# EAGLE schematic adc2 (EAGLE 5.06)
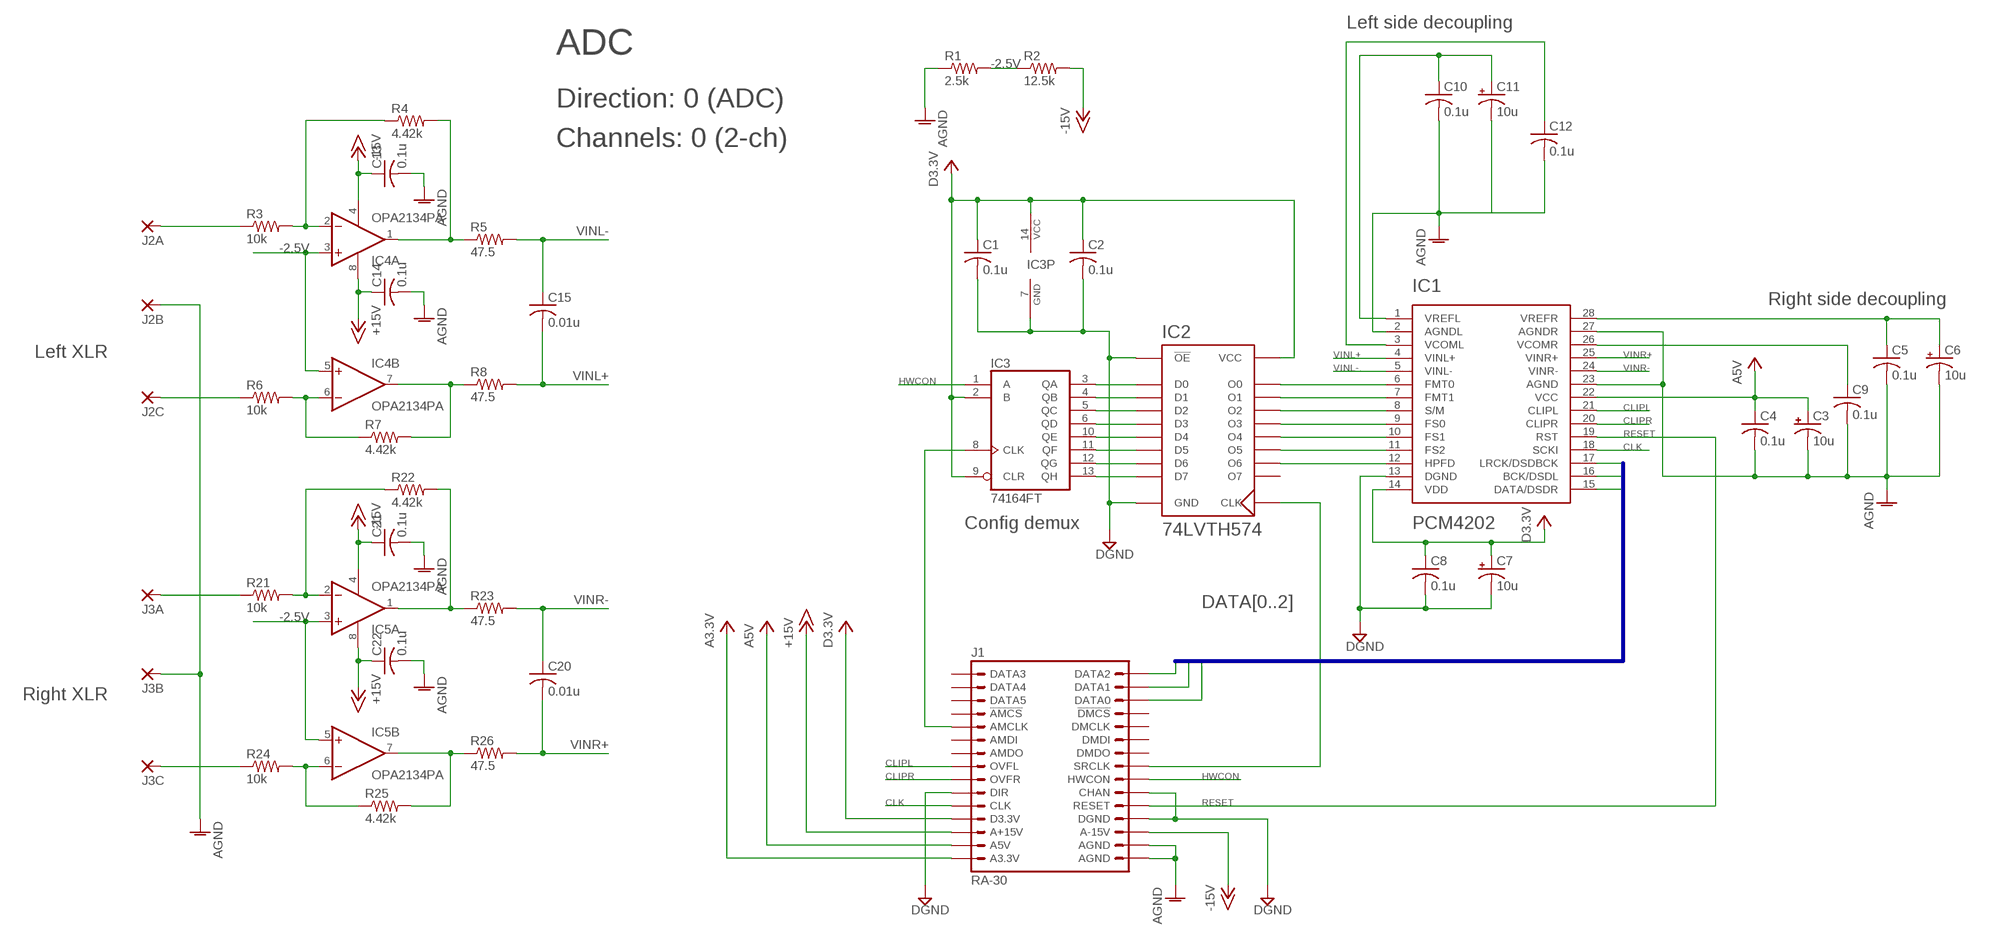
[diagram p0: schematic, sheet 1]

## Parts
C1  0.1u  C-USC1206  [C1206]
C2  0.1u  C-USC1206  [C1206]
C3  10u  CPOL-USC/6032-28R  [C/6032-28R]
C4  0.1u  C-USC1206  [C1206]
C5  0.1u  C-USC1206  [C1206]
C6  10u  CPOL-USC/6032-28R  [C/6032-28R]
C7  10u  CPOL-USC/6032-28R  [C/6032-28R]
C8  0.1u  C-USC1206  [C1206]
C9  0.1u  C-USC1206  [C1206]
C10  0.1u  C-USC1206  [C1206]
C11  10u  CPOL-USC/6032-28R  [C/6032-28R]
C12  0.1u  C-USC1206  [C1206]
C13  0.1u  C-USC1206  [C1206]
C14  0.1u  C-USC1206  [C1206]
C15  0.01u  C-USC1812  [C1812]
C20  0.01u  C-USC1812  [C1812]
C21  0.1u  C-USC1206  [C1206]
C22  0.1u  C-USC1206  [C1206]
IC1  PCM4202  [SSOP28]
IC2  74LVTH574  [TSSOP20]
IC3  74164FT  [TSSOP14]
IC4  OPA2134PA  [DIL08]
IC5  OPA2134PA  [DIL08]
J1  RA-30  [FCI-RA-30]
J2A  2,54/1,1  [2,54/1,1]
J2B  2,54/1,1  [2,54/1,1]
J2C  2,54/1,1  [2,54/1,1]
J3A  2,54/1,1  [2,54/1,1]
J3B  2,54/1,1  [2,54/1,1]
J3C  2,54/1,1  [2,54/1,1]
R1  2.5k  R-US_R1206  [R1206]
R2  12.5k  R-US_R1206  [R1206]
R3  10k  R-US_R1206  [R1206]
R4  4.42k  R-US_R1206  [R1206]
R5  47.5  R-US_R1206  [R1206]
R6  10k  R-US_R1206  [R1206]
R7  4.42k  R-US_R1206  [R1206]
R8  47.5  R-US_R1206  [R1206]
R21  10k  R-US_R1206  [R1206]
R22  4.42k  R-US_R1206  [R1206]
R23  47.5  R-US_R1206  [R1206]
R24  10k  R-US_R1206  [R1206]
R25  4.42k  R-US_R1206  [R1206]
R26  47.5  R-US_R1206  [R1206]

## Nets
+15V: C14.1 C22.1 IC4.8(A:V+) IC5.8(A:V+) J1.P$A28(A+15V)
-2.5V: IC4.3(A:+IN) IC4.5(B:+IN) IC5.3(A:+IN) IC5.5(B:+IN) R1.2 R2.1
-15V: C13.1 C21.1 IC4.4(A:V-) IC5.4(A:V-) J1.P$A3(A-15V) R2.2
A3.3V: J1.P$A30(A3.3V)
A5V: C3.+ C4.1 IC1.22(VCC) J1.P$A29(A5V)
AGND: C3.- C4.2 C5.2 C6.- C9.2 C10.2 C11.- C12.2 C13.2 C14.2 C21.2 C22.2 IC1.2(AGNDL) IC1.23(AGND) IC1.27(AGNDR) J1.P$A1(AGND) J1.P$A2(AGND) J2B.1(P) J3B.1(P) R1.1
CLIPL: IC1.21(CLIPL) J1.P$A23(OVFL)
CLIPR: IC1.20(CLIPR) J1.P$A24(OVFR)
CLK: IC1.18(SCKI) J1.P$A26(CLK)
D3.3V: C1.1 C2.1 C7.+ C8.1 IC1.14(VDD) IC2.20(VCC) IC3.2(B) IC3.9(CLR) IC3.14(VCC) J1.P$A27(D3.3V)
DATA0: IC1.17(LRCK/DSDBCK) J1.P$A13(DATA0)
DATA1: IC1.16(BCK/DSDL) J1.P$A14(DATA1)
DATA2: IC1.15(DATA/DSDR) J1.P$A15(DATA2)
DGND: C1.2 C2.2 C7.- C8.2 IC1.13(DGND) IC2.1(!OE) IC2.10(GND) IC3.7(GND) J1.P$A4(DGND) J1.P$A6(CHAN) J1.P$A25(DIR)
HWCON: IC3.1(A) J1.P$A7(HWCON)
N$1: IC2.2(D0) IC3.3(QA)
N$2: IC2.3(D1) IC3.4(QB)
N$3: IC2.4(D2) IC3.5(QC)
N$4: IC2.5(D3) IC3.6(QD)
N$5: IC2.6(D4) IC3.10(QE)
N$6: IC2.7(D5) IC3.11(QF)
N$7: IC2.8(D6) IC3.12(QG)
N$8: IC3.8(CLK) J1.P$A20(AMCLK)
N$9: IC2.9(D7) IC3.13(QH)
N$10: IC1.6(FMT0) IC2.19(O0)
N$11: IC1.7(FMT1) IC2.18(O1)
N$12: IC1.8(S/M) IC2.17(O2)
N$13: IC1.9(FS0) IC2.16(O3)
N$14: IC1.10(FS1) IC2.15(O4)
N$15: IC1.11(FS2) IC2.14(O5)
N$16: IC1.12(HPFD) IC2.13(O6)
N$18: C10.1 C11.+ IC1.1(VREFL)
N$19: C5.1 C6.+ IC1.28(VREFR)
N$20: C9.1 IC1.26(VCOMR)
N$21: IC4.2(A:-IN) R3.2 R4.1
N$22: C12.1 IC1.3(VCOML)
N$23: IC4.6(B:-IN) R6.2 R7.1
N$24: IC4.1(A:OUT) R4.2 R5.1
N$25: IC5.2(A:-IN) R21.2 R22.1
N$26: IC4.7(B:OUT) R7.2 R8.1
N$27: IC2.11(CLK) J1.P$A8(SRCLK)
N$29: IC5.1(A:OUT) R22.2 R23.1
N$30: IC5.6(B:-IN) R24.2 R25.1
N$31: IC5.7(B:OUT) R25.2 R26.1
RESET: IC1.19(RST) J1.P$A5(RESET)
SVINL+: J2A.1(P) R3.1
SVINL-: J2C.1(P) R6.1
SVINR+: J3A.1(P) R21.1
SVINR-: J3C.1(P) R24.1
VINL+: C15.2 IC1.4(VINL+) R8.2
VINL-: C15.1 IC1.5(VINL-) R5.2
VINR+: C20.2 IC1.25(VINR+) R26.2
VINR-: C20.1 IC1.24(VINR-) R23.2
Unconnected: IC2.12(O7) J1.P$A9(DMDO) J1.P$A10(DMDI) J1.P$A11(DMCLK) J1.P$A12(!DMCS) J1.P$A16(DATA3) J1.P$A17(DATA4) J1.P$A18(DATA5) J1.P$A19(!AMCS) J1.P$A21(AMDI) J1.P$A22(AMDO)

## Buses
DATA[0..2]

## Notes on the sheet
- Left side decoupling
- ADC
- Direction: 0 (ADC)
- Channels: 0 (2-ch)
- Right side decoupling
- Left XLR
- Config demux
- Right XLR

## Library data of the parts
C1 C2 C4 C5 C8-C10 C12-C15 C20-C22 = rcl:C-US: CAPACITOR, American symbol
C3 C6 C7 C11 = rcl:CPOL-US: POLARIZED CAPACITOR, American symbol
IC1 = cdp:PCM4202
IC2 = cdp:74LVTH574
IC3 = cdp:74*164: 8-bit parallel out SHIFT REGISTER
IC4 IC5 = linear:OPA2*: Dual Operational Amplifier Low Power, Single-Supply, Rail-To-Rail Operational Amplifier Source: http://focus.ti.com/lit/ds/symlink/opa2345.pdf http://focus.ti.com .. opa241.pdf http://focus.ti.com/lit/ds/symlink/opa2134.pdf
J1 = cdp:RA-30
J2A J2B J2C J3A J3B J3C = wirepad:2,54/1,1: THROUGH-HOLE PAD
R1-R8 R21-R26 = rcl:R-US_: RESISTOR, American symbol